# EAGLE design Raspberry_output_for_DC_slave (EAGLE 5.10)
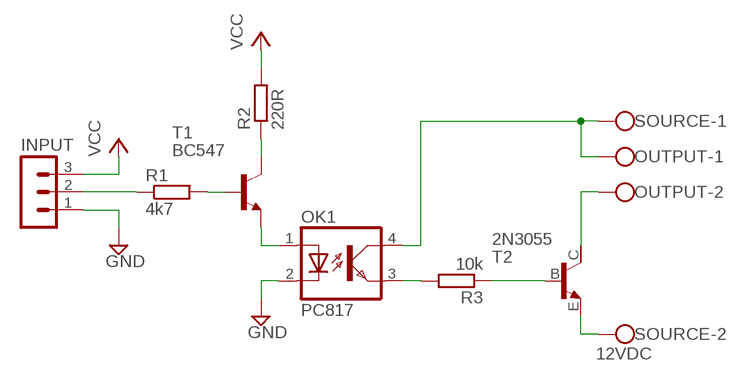
[diagram p0: schematic, sheet 1]

## Parts
INPUT  MA03-1  [MA03-1]
OK1  PC817  [DIL04]
OUTPUT  W237-102  [W237-102]
R1  4k7  R-EU_0207/10  [0207/10]
R2  220R  R-EU_0207/10  [0207/10]
R3  10k  R-EU_0207/10  [0207/10]
SOURCE  12VDC  W237-102  [W237-102]
T1  BC547  [TO92]
T2  2N3055  [TO3]

## Nets
GND: INPUT.1 OK1.2(C)
INPUT: INPUT.2 R1.1
INPUT_REGULATED_CURR_2_BASE: R1.2 T1.2(B)
N$2: R2.1 T1.3(C)
OPTO_IN: OK1.1(A) T1.1(E)
OPTO_OUT_2_TR: OK1.3(EMIT) R3.2
OUTPUT_N: OUTPUT.2 T2.C
SOURCE_N_0V: SOURCE.2 T2.E
SOURCE_P_12V: OK1.4(COL) OUTPUT.1 SOURCE.1
TR_OUTPUT_BASE: R3.1 T2.B
VCC: INPUT.3 R2.2
Unconnected: T2.C/(C)

## Library data of the parts
INPUT = con-lstb:MA03-1: PIN HEADER
OK1 = optocoupler:PC817: SHARP OPTO COUPLER
OUTPUT SOURCE = con-wago-500:W237-102: WAGO SCREW CLAMP
R1-R3 = rcl:R-EU_: RESISTOR, European symbol
T1 = transistor-neu-to92:BC547: NPN TRANSISTOR
T2 = transistor:2N3055: NPN TRANSISTOR

## Board
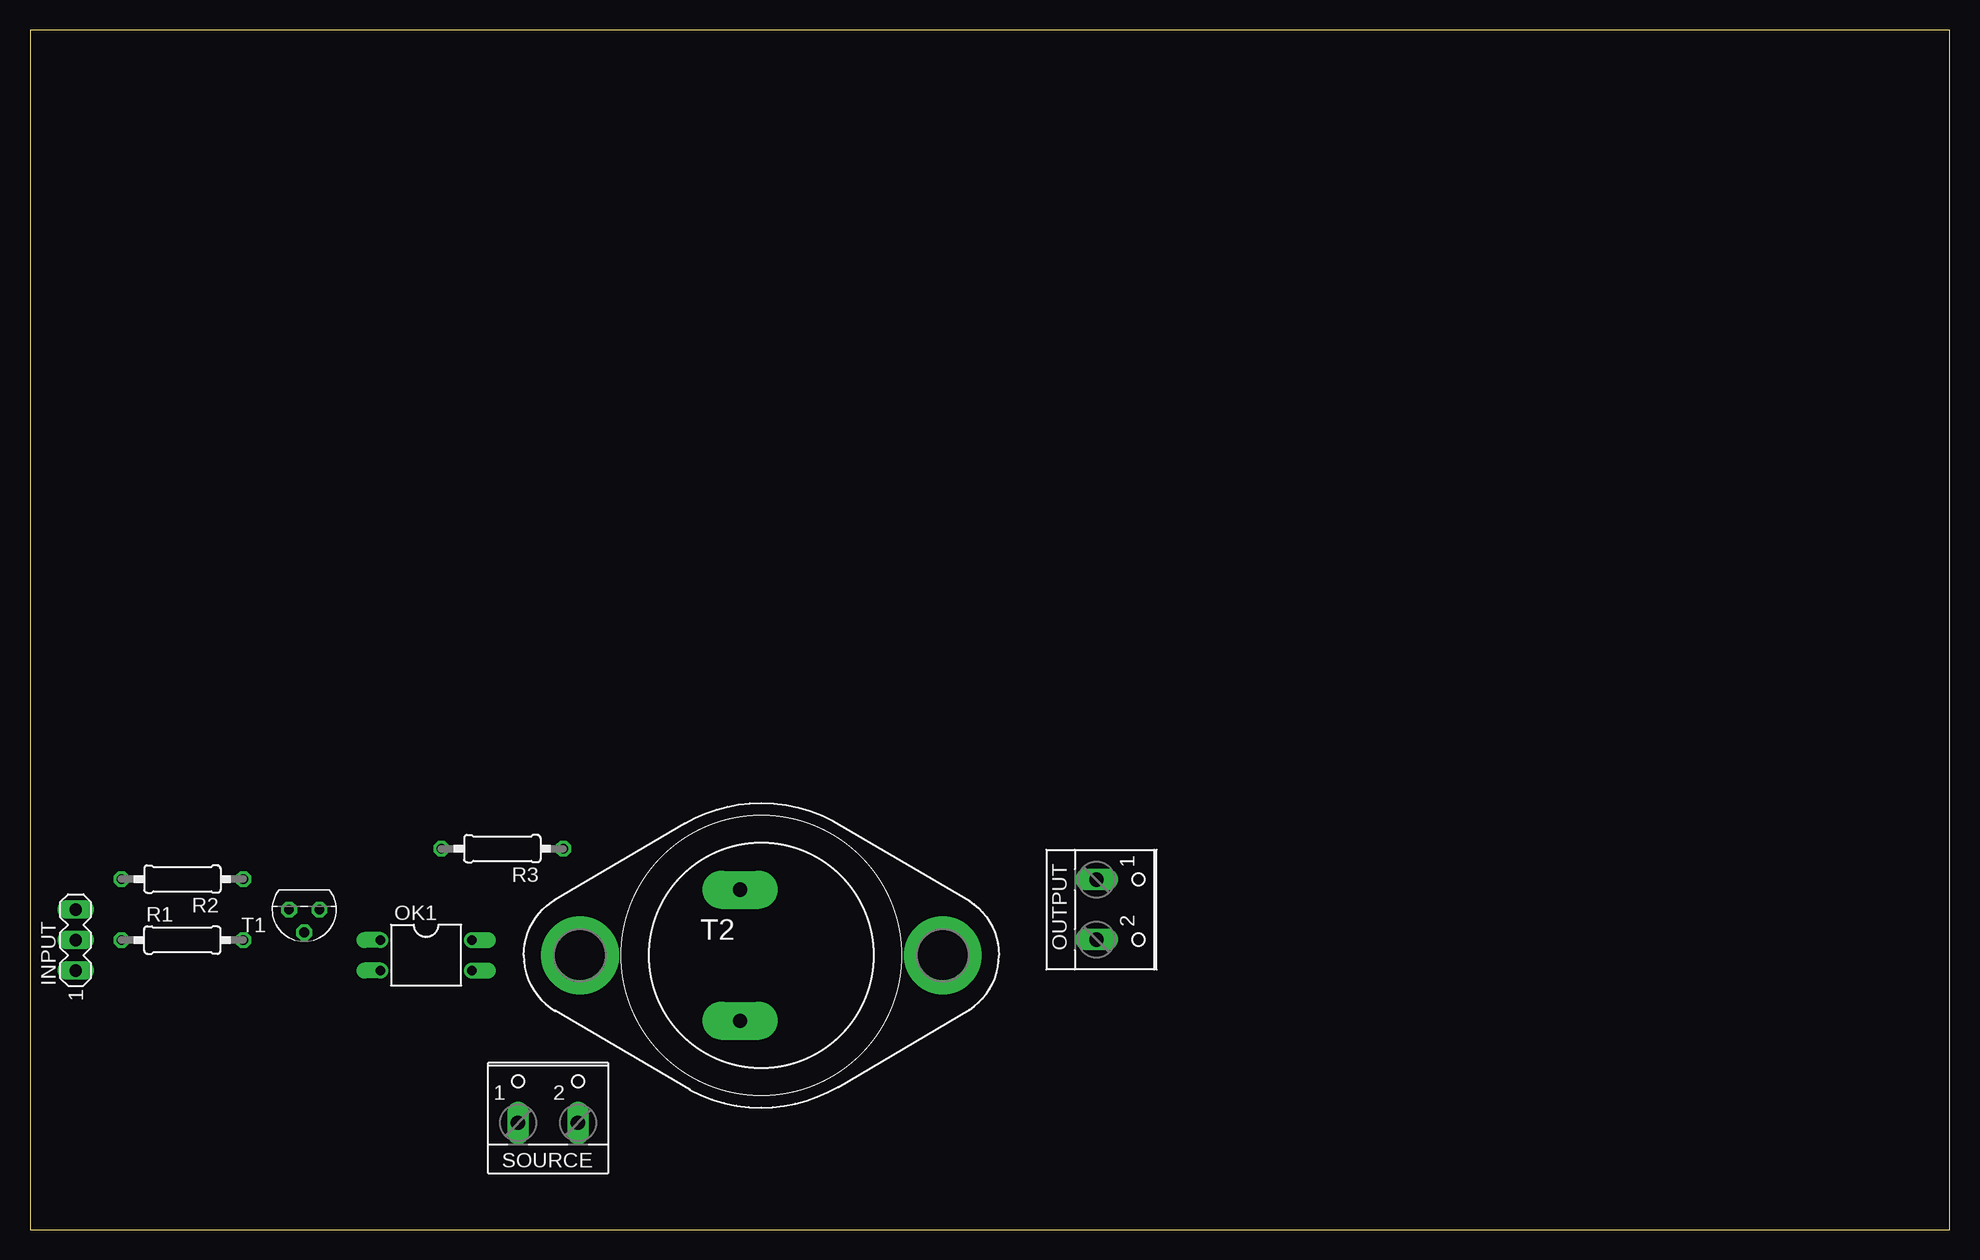
[diagram p1: board, top side]
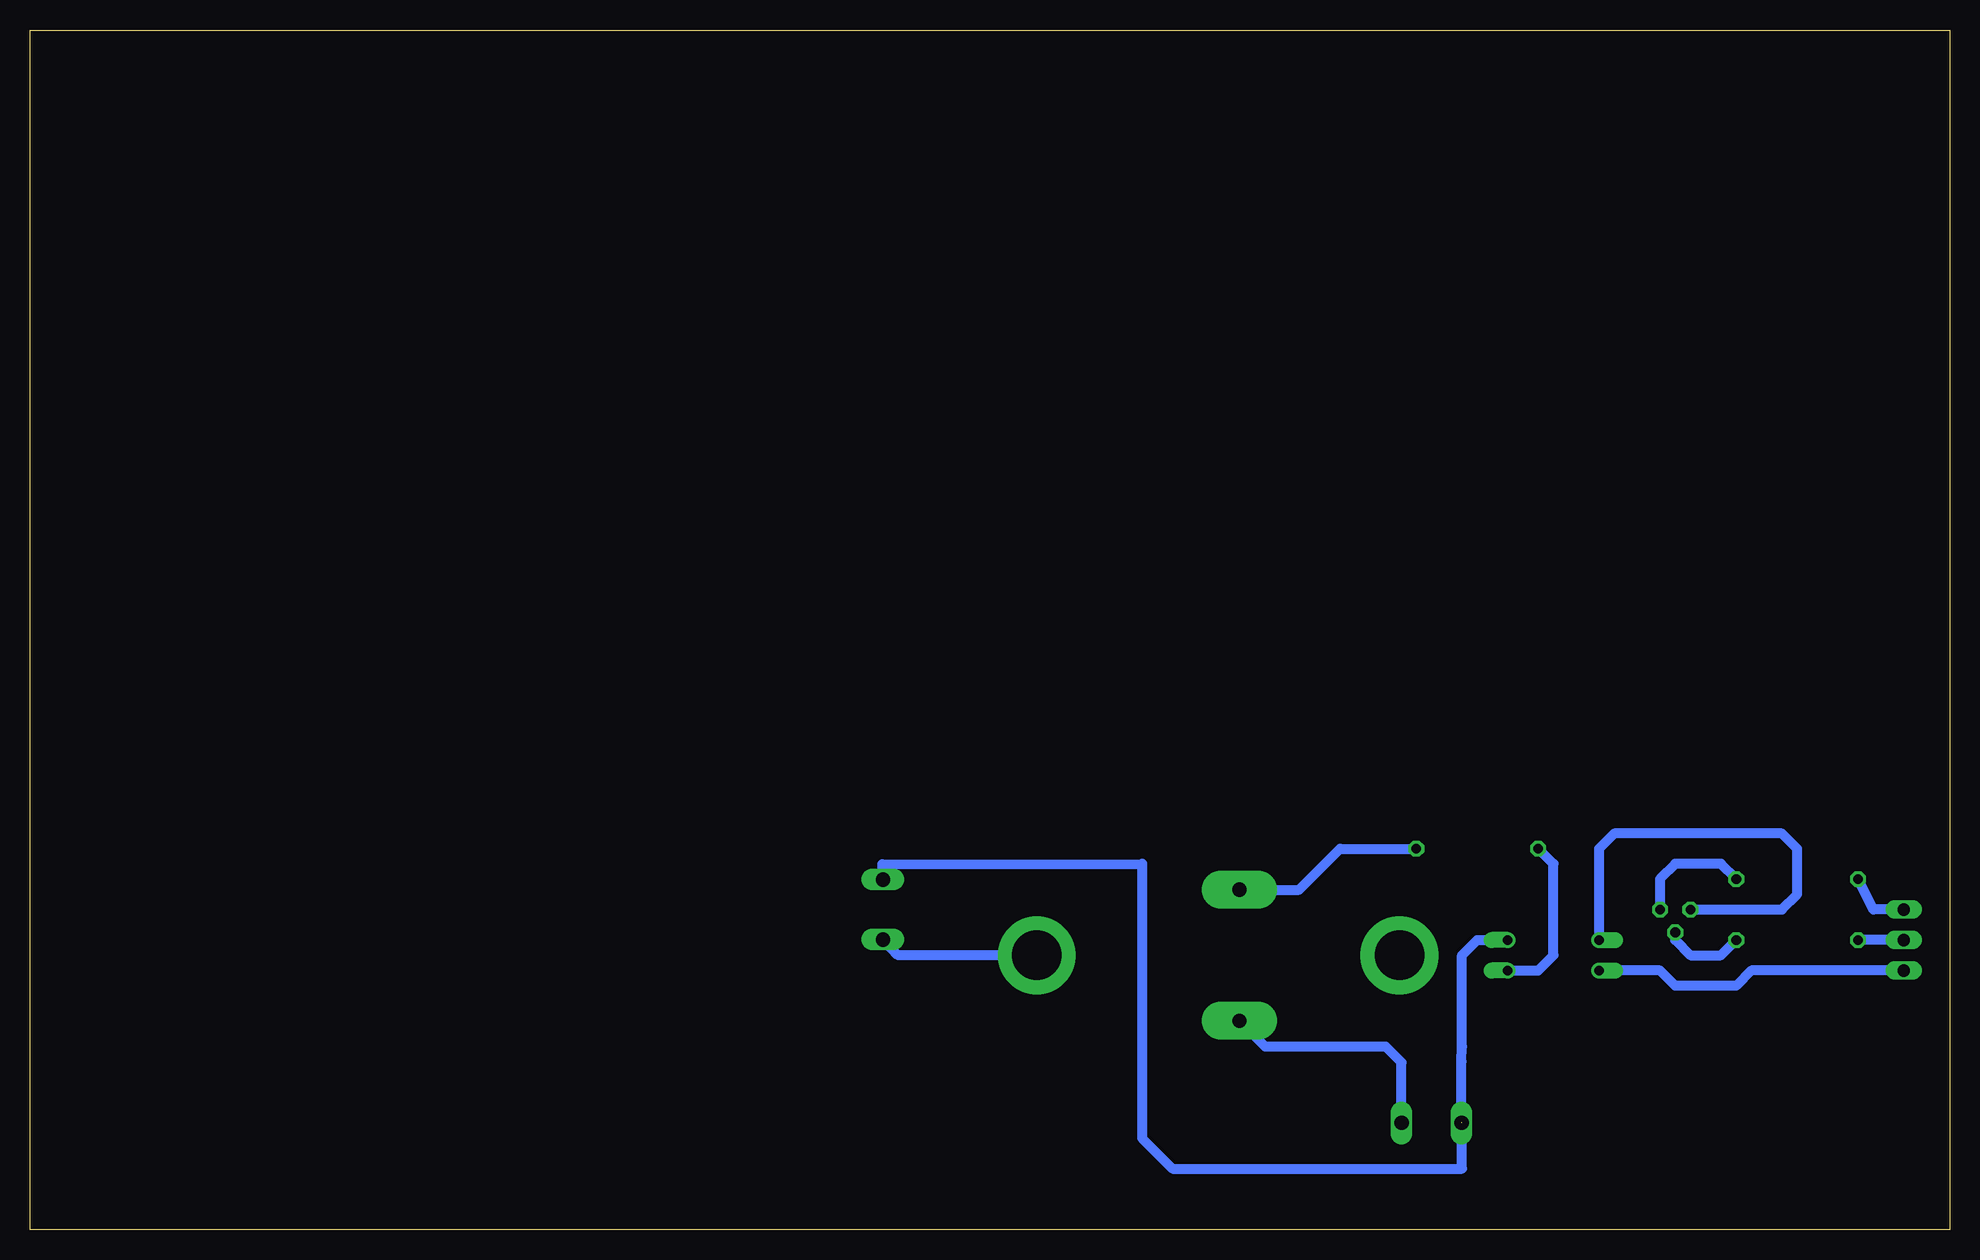
[diagram p2: board, bottom side, seen from below]

Size 160 x 100 mm. Coordinates in mm from the lower left corner, seen from the top.
Outline: 0,0 160,0 160,100 0,100 0,0
Copper layers (1*16): Top 0.035mm / dielectric 1.5mm / Bottom 0.035mm
Design rules "default": minimum track width 10mil, minimum drill 24mil, track to track 8mil, track to pad 8mil, pad to pad 8mil, via to via 8mil, smd to smd 8mil, copper to edge 40mil, drill to drill 8mil, minimum pad ring 10mil, minimum via ring 8mil, stop-mask expansion 4mil, vias tented up to drill 0mil, thermal gap 10mil

### Footprints (pad centres in the part's own frame; a part is rotated, then mirrored left to right if it is on the bottom)
MA03-1 = drill 1.016 long: 1 -2.54,0; 2 0,0; 3 2.54,0
DIL04 = drill 0.813 offset: 1 -1.27,-3.81; 2 1.27,-3.81; 3 1.27,3.81; 4 -1.27,3.81
W237-102 = drill 1.194 long: 1 -2.5,-1.27; 2 2.5,-1.27
0207/10 = drill 0.813 octagon: 1 -5.08,0; 2 5.08,0
TO92 = drill 0.813 octagon: 1 1.27,0; 2 0,1.905; 3 -1.27,0
TO3 = drill 1.194 pad 3.15 long: B -1.778,5.461; E -1.778,-5.461 | drill 4.115 pad 6.477 round: C 15.113,0; C/ -15.113,0

### Placement (x,y rotation side)
INPUT  3.81,24.13 90 top
OK1  33.02,22.86 270 top
OUTPUT  90.17,26.67 270 top
R1  12.7,24.13 0 top
R2  12.7,29.21 180 top
R3  39.37,31.75 180 top
SOURCE  43.18,10.16 0 top
T1  22.86,26.67 180 top
T2  60.96,22.86 0 top

### Tracks (layer width: path | path; a pad name or v marks a point on that pad's centre or on a via)
GND
  Bottom 0.813: INPUT.1 16.51,21.59 17.78,20.32 22.86,20.32 24.13,21.59 OK1.2
INPUT
  Bottom 0.813: INPUT.2 R1.1
INPUT_REGULATED_CURR_2_BASE
  Bottom 0.813: T1.2 22.86,24.13 21.59,22.86 19.05,22.86 R1.2
N$2
  Bottom 0.813: R2.1 19.05,30.48 22.86,30.48 24.13,29.21 T1.3
OPTO_IN
  Bottom 0.813: T1.1 13.97,26.67 12.7,27.94 12.7,31.75 13.97,33.02 27.94,33.02 29.21,31.75 OK1.1
OPTO_OUT_2_TR
  Bottom 0.813: OK1.3 34.29,21.59 33.02,22.86 33.02,30.48 R3.2
OUTPUT_N
  Bottom 0.813: T2.C 87.63,22.86 OUTPUT.2
SOURCE_N_0V
  Bottom 0.813: SOURCE.2 45.68,13.93 46.99,15.24 57.02,15.24 T2.E
SOURCE_P_12V  (1 unrouted)
  Bottom 0.813: SOURCE.1 40.68,14.01 40.64,15.24 40.64,22.86 39.37,24.13 OK1.4 | OUTPUT.1 88.94,30.44 67.31,30.48 67.31,7.62 64.77,5.08 40.64,5.08 40.64,8.89
TR_OUTPUT_BASE
  Bottom 0.813: T2.B 54.23,28.32 50.8,31.75 R3.1
VCC
  Bottom 0.813: INPUT.3 6.35,26.67 R2.2